# Altium schematic sheet CAN.SchDoc: CAN
size A4; CompanyName: TM; DrawnBy: Juan Tinazzo; SheetNumber: 3; SheetTotal: 7; Number: 25
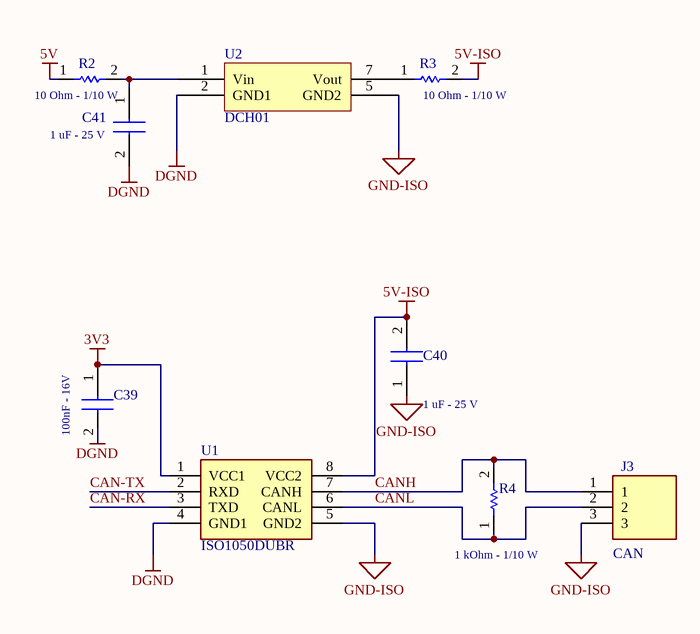
[diagram p0: CAN.SchDoc]

## Parts
C39  value 100nF - 16V  [CAPC1608X95N]  (hidden comment: 100n 16V 0603)
C40  value 1 uF - 25 V  [CAPC2012X135N]  (hidden comment: 1u)
C41  value 1 uF - 25 V  [CAPC2012X135N]  (hidden comment: 1u)
J3  CAN  [76384303LF]
R2  value 10 Ohm - 1/10 W  [RESC1608X50N]  (hidden comment: CRCW060310R0FKEAHP)
R3  value 10 Ohm - 1/10 W  [RESC1608X50N]  (hidden comment: CRCW060310R0FKEAHP)
R4  value 1 kOhm - 1/10 W  [RESC1608X55N]  (hidden comment: CRCW06031K00FKEAC)
U1  ISO1050DUBR  [SOP254P1040X485-8N]
U2  DCH01  [DCH01]

## Nets
3V3: C39.1 U1.1(VCC1)
5V: R2.1
5V-ISO: C40.2 R3.2 U1.8(VCC2)
DGND: C39.2 C41.2 U1.4(GND1) U2.2(GND1)
GND-ISO: C40.1 J3.3 U1.5(GND2) U2.5(GND2)
CAN-RX: U1.3(TXD)
CAN-TX: U1.2(RXD)
CANH: J3.1 R4.2 U1.7(CANH)
CANL: J3.2 R4.1 U1.6(CANL)
NetC41_1: C41.1 R2.2 U2.1(Vin)
NetR3_1: R3.1 U2.7(Vout)

## Notes on the sheet
- Title
- Size:
- Project:
- A4
- Number:
- Revision:
- Sheet
- of
- Drawn by:
- Company:
- File:

## Library data of the parts
C39 = EMK107B7104KA-T: Capacitor; Manufacturer_Name: TAIYO YUDEN; Datasheet Link: http://www.farnell.com/datasheets/746258.pdf; Height: 0.95mm; Manufacturer_Part_Number: EMK107B7104KA-T; Mouser Part Number: 963-EMK107B7104KA-T; Mouser Price/Stock: https://www.mouser.co.uk/ProductDetail/TAIYO-YUDEN/EMK107B7104KA-T?qs=I6KAKw0tg2ybqzX8hKPgfw%3D%3D; Arrow Part Number: EMK107B7104KA-T; Arrow Price/Stock: https://www.arrow.com/en/products/emk107b7104ka-t/taiyo-yuden
C40 C41 = CL21B105KAFNNNG: Capacitor; Manufacturer_Name: SAMSUNG; Datasheet Link: https://datasheet.datasheetarchive.com/originals/distributors/Datasheets-DGA8/2478773.pdf; Height: 1.35mm; Manufacturer_Part_Number: CL21B105KAFNNNG; Mouser Part Number: 187-CL21B105KAFNNNG; Mouser Price/Stock: https://www.mouser.co.uk/ProductDetail/Samsung-Electro-Mechanics/CL21B105KAFNNNG?qs=yOVawPpwOwmXkU%252BG0TK%2F5g%3D%3D; Arrow Part Number: CL21B105KAFNNNG; Arrow Price/Stock: https://www.arrow.com/en/products/cl21b105kafnnng/samsung-electro-mechanics?region=europe
J3 = 76384-303LF: Connector; Manufacturer_Name: Amphenol Communications Solutions; Value: Alojamientos de cables y cabecera 3P VERT; Datasheet Link: https://cdn.amphenol-cs.com/media/wysiwyg/files/drawing/76384.pdf; Height: 9.49mm; Manufacturer_Part_Number: 76384-303LF; Mouser Part Number: 649-76384-303LF; System: Connector
R2 R3 = CRCW060310R0FKEAHP: Resistor; Manufacturer_Name: Vishay; Datasheet Link: http://www.farnell.com/datasheets/1885357.pdf; Height: 0.5mm; Manufacturer_Part_Number: CRCW060310R0FKEAHP; Mouser Part Number: 71-CRCW060310R0FKEAH; Mouser Price/Stock: https://www.mouser.co.uk/ProductDetail/Vishay-Dale/CRCW060310R0FKEAHP?qs=k2%2FDWSARqgHKJ7AdmQKyZw%3D%3D; Arrow Part Number: CRCW060310R0FKEAHP; Arrow Price/Stock: https://www.arrow.com/en/products/crcw060310r0fkeahp/vishay?region=nac
R4 = CRCW06031K00FKEAC: Resistor; Manufacturer_Name: Vishay; Datasheet Link: https://www.vishay.com/docs/28773/crcwce3.pdf; Height: 0.55mm; Manufacturer_Part_Number: CRCW06031K00FKEAC; Mouser Part Number: 71-CRCW06031K00FKEAC; Mouser Price/Stock: https://www.mouser.co.uk/ProductDetail/Vishay-Dale/CRCW06031K00FKEAC?qs=E3Y5ESvWgWOQ7ePIWbGVFg%3D%3D; Arrow Part Number: CRCW06031K00FKEAC; Arrow Price/Stock: https://www.arrow.com/en/products/crcw06031k00fkeac/vishay?region=nac
U1 = ISO1050DUBR: Integrated Circuit; Manufacturer_Name: Texas Instruments; Value: Aisladores digitales Iso 5V CAN Xcvr; Datasheet Link: http://www.ti.com/lit/ds/symlink/iso1050.pdf; Height: 4.85mm; Manufacturer_Part_Number: ISO1050DUBR; Mouser Part Number: 595-ISO1050DUBR; Mouser Price/Stock: https://www.mouser.co.uk/ProductDetail/Texas-Instruments/ISO1050DUBR?qs=IK5e5L0zOXhhp9hdAolE%252BA%3D%3D; Arrow Part Number: ISO1050DUBR; Arrow Price/Stock: https://www.arrow.com/en/products/iso1050dubr/texas-instruments?region=nac
U2 = DCH01: Value: Miniature Isolated DC/DC Converters; Manufacturer_Part_Number: DCH01